# Altium schematic sheet 04-ORIN_HIGH_SPEED_SIGNAL_2.SchDoc: KARGOBOT-TBOX-V2.0
size 513 x 386 mm; Page Create Date: March  8, 1995; Page Number: 7; Page Size: C; Page Count: 81; RevCode: A; DsnPath: C:\Users\Administrator\Desktop\123\KARGOBOT-TCU-ORIN-V1.1.DSN; SchematicName: KARGOBT-TCU-ORIN-V1.1; PageName: 07-ORIN_HIGH_SPEED_SIGNAL_2; PageSize: C; TopSchematic: True
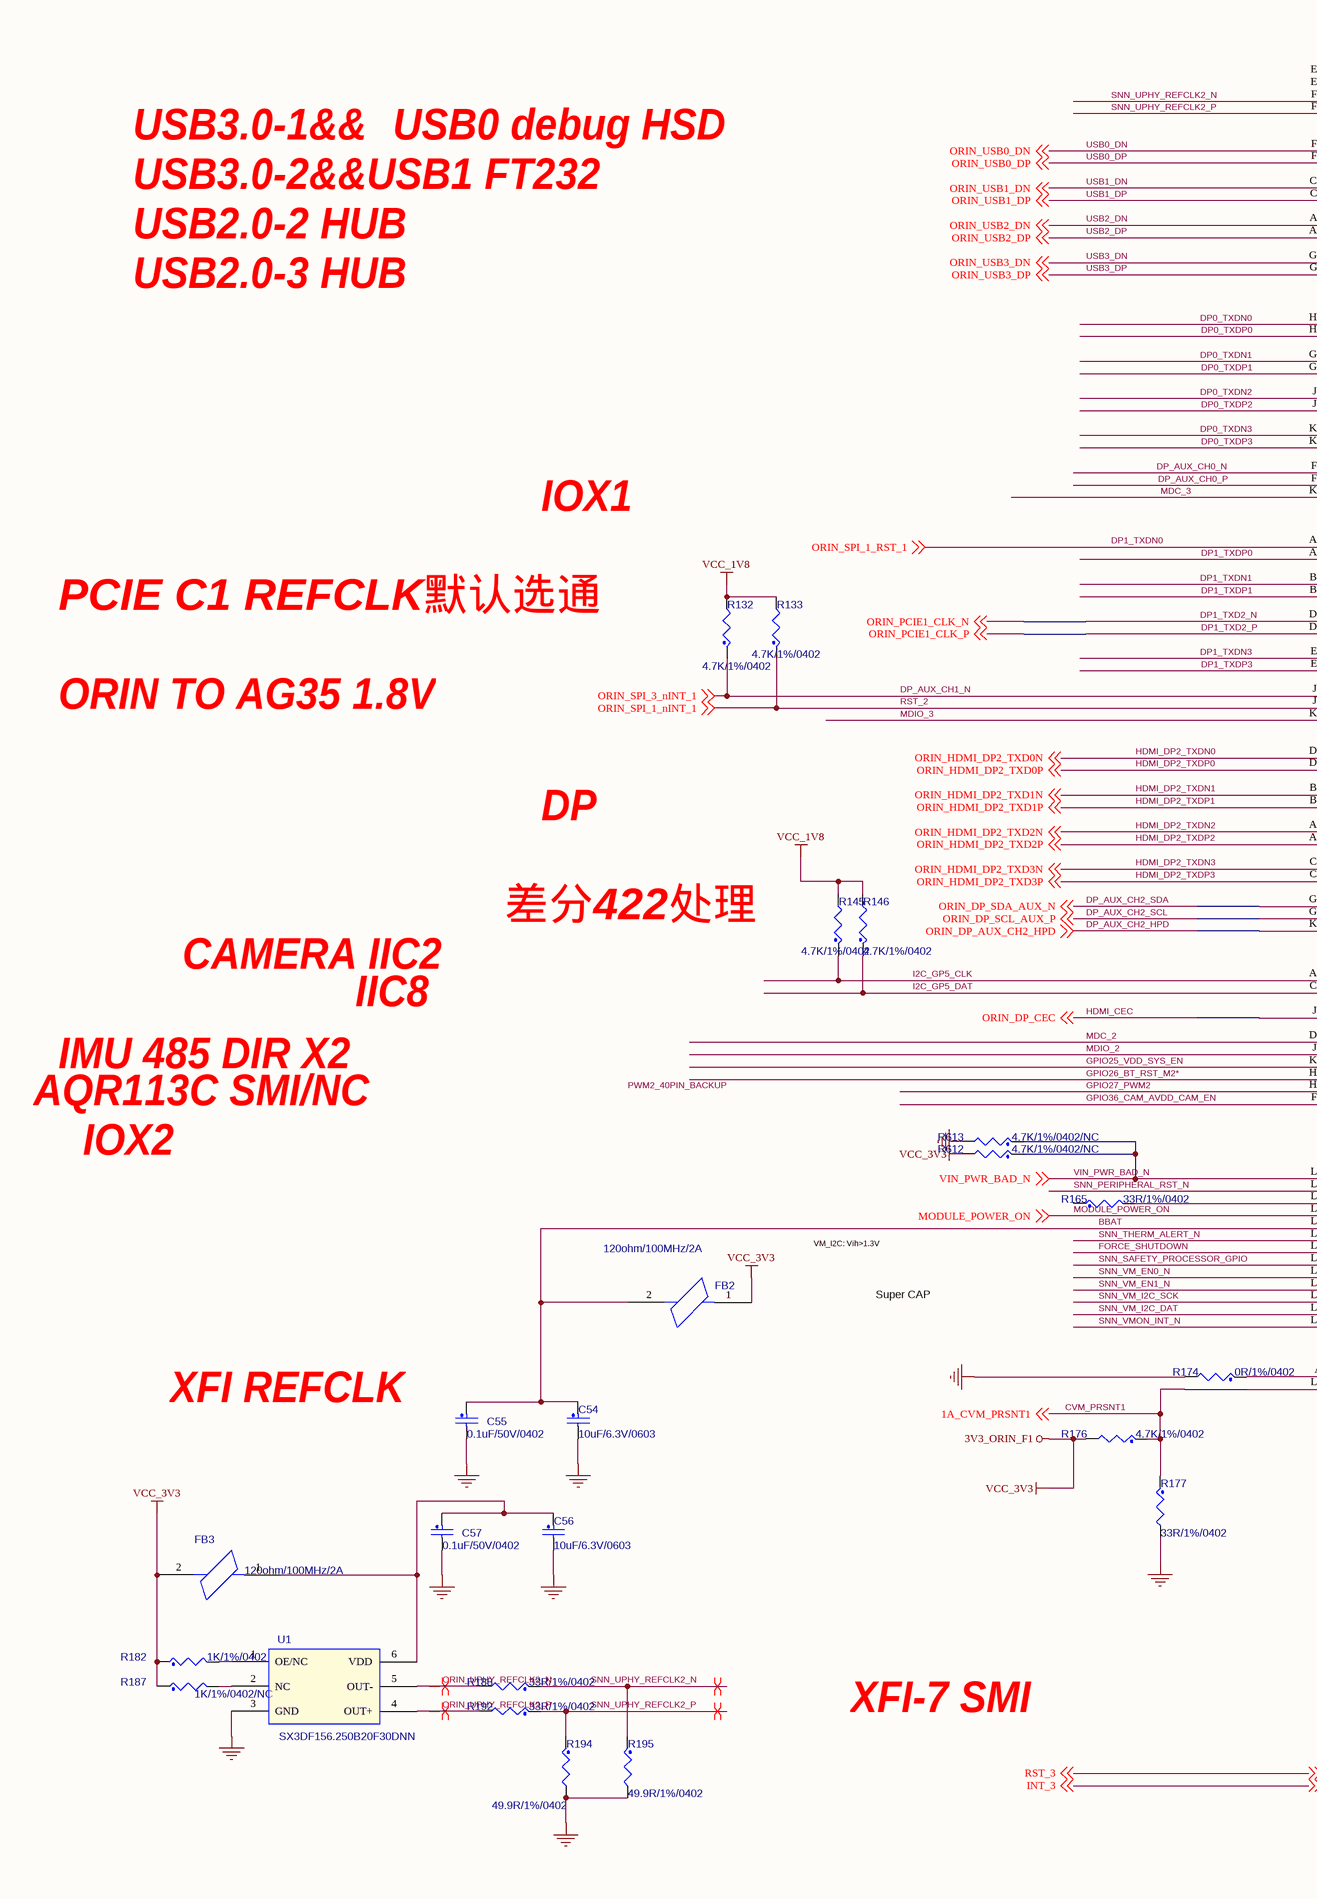
[diagram p0: 04-ORIN_HIGH_SPEED_SIGNAL_2.SchDoc, left]
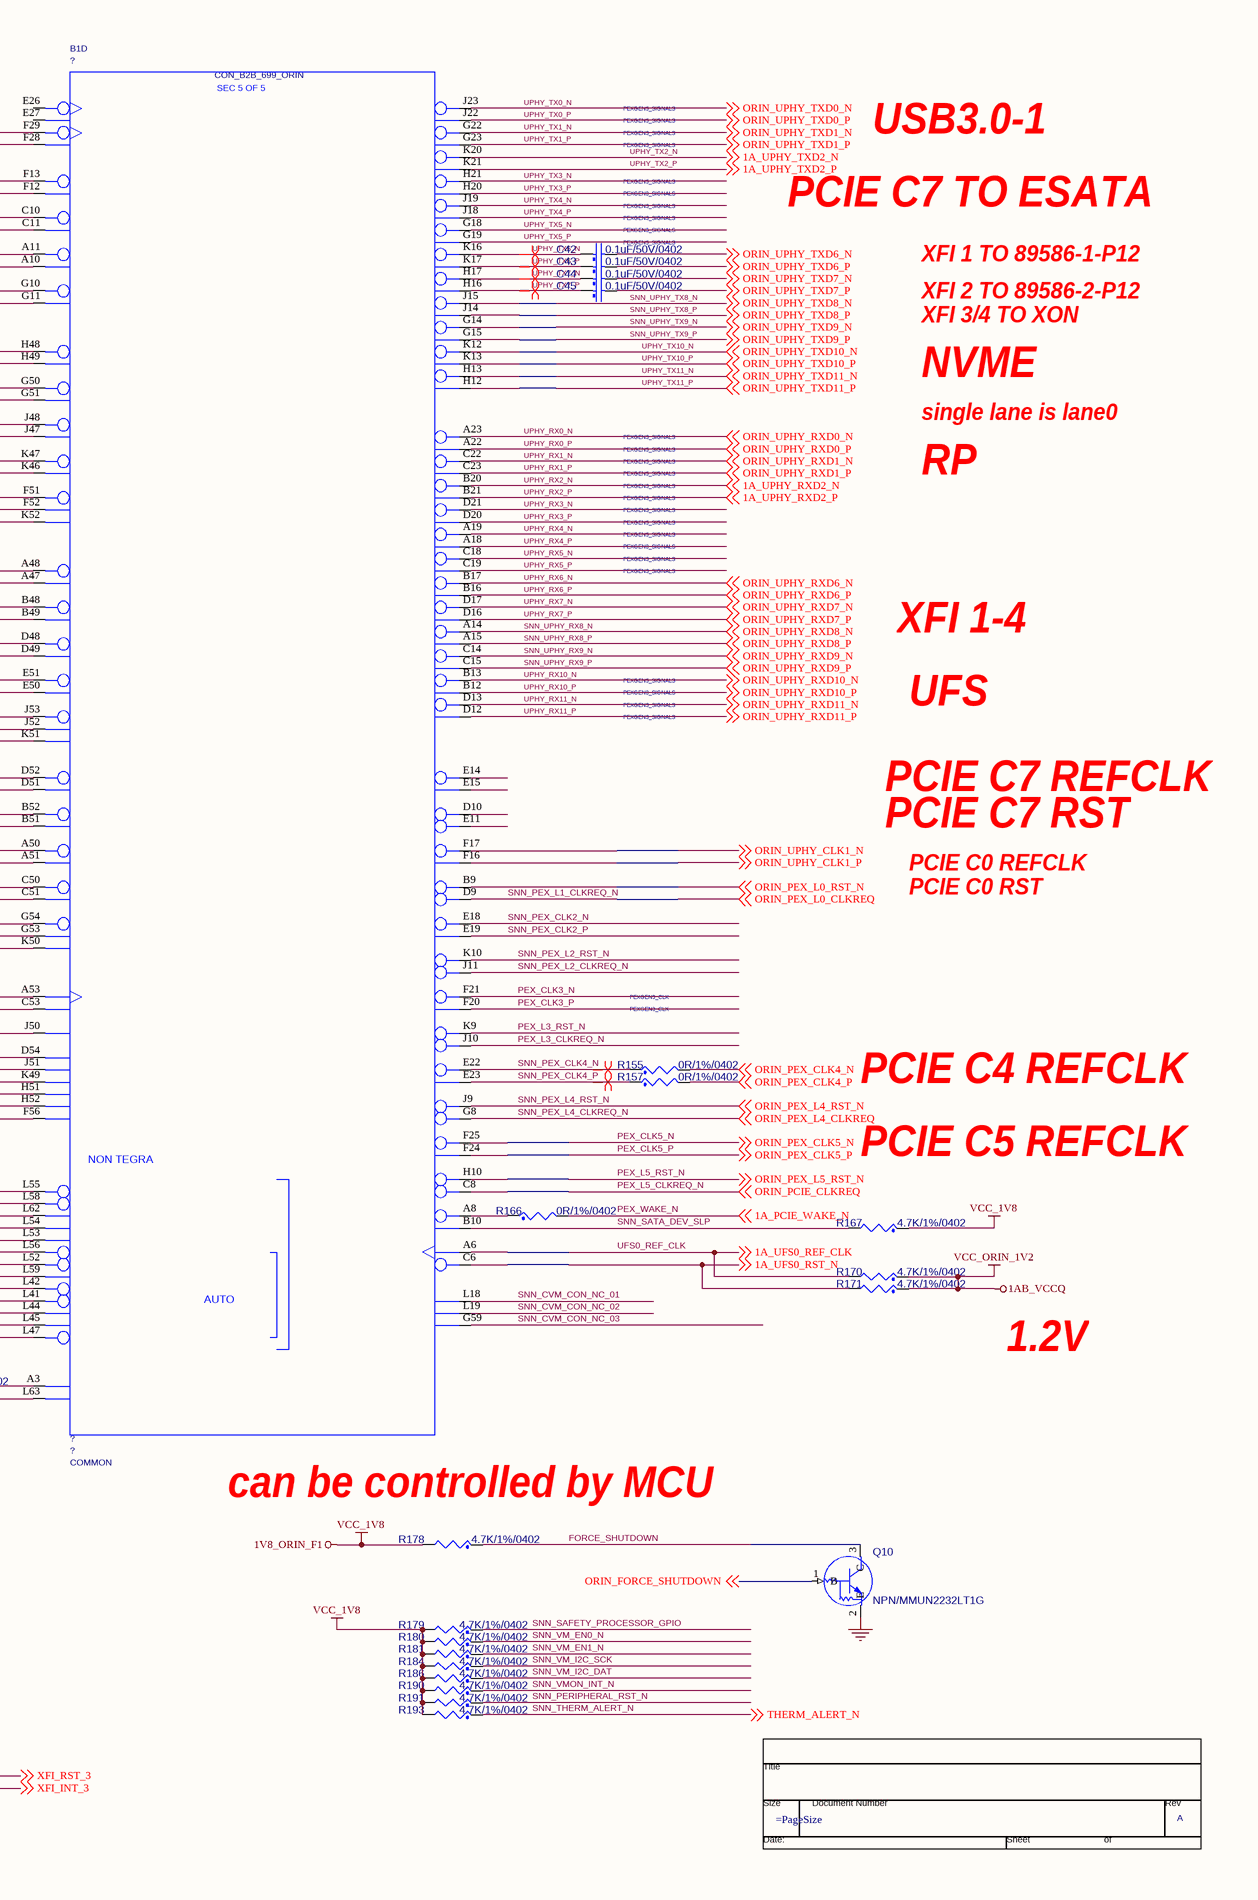
[diagram p1: 04-ORIN_HIGH_SPEED_SIGNAL_2.SchDoc, right]

## Parts
*  RevCode: A  (graphical)
B1  SKU: COMMON  [CON_MIRMEZ_699_BGA_ST_P009_P013_P015_REVERSE]  (hidden comment: CON_B2B_699_ORIN)  (part D of 5)
C42  value 0.1uF/50V/0402  [C0402]  (hidden comment: CAP_NP)
C43  value 0.1uF/50V/0402  [C0402]  (hidden comment: CAP_NP)
C44  value 0.1uF/50V/0402  [C0402]  (hidden comment: CAP_NP)
C45  value 0.1uF/50V/0402  [C0402]  (hidden comment: CAP_NP)
C54  value 10uF/6.3V/0603  [C0603]  (hidden comment: CAP_NP)
C55  value 0.1uF/50V/0402  [C0402]  (hidden comment: CAP_NP)
C56  value 10uF/6.3V/0603  [C0603]  (hidden comment: CAP_NP)
C57  value 0.1uF/50V/0402  [C0402]  (hidden comment: CAP_NP)
FB2  value 120ohm/100MHz/2A  [L0603]  (hidden comment: BEAD_FERRITE)
FB3  value 120ohm/100MHz/2A  [L0603]  (hidden comment: BEAD_FERRITE)
Q10  NPN/MMUN2232LT1G  [SOT-23]
R132  value 4.7K/1%/0402  [R0402]  (hidden comment: RES_Dup2)
R133  value 4.7K/1%/0402  [R0402]  (hidden comment: RES_Dup2)
R145  value 4.7K/1%/0402  [R0402]  (hidden comment: RES_Dup2)
R146  value 4.7K/1%/0402  [R0402]  (hidden comment: RES_Dup2)
R155  value 0R/1%/0402  [R0402]  (hidden comment: RES_Dup2)
R157  value 0R/1%/0402  [R0402]  (hidden comment: RES_Dup2)
R165  value 33R/1%/0402  [R0402]  (hidden comment: RES_Dup2)
R166  value 0R/1%/0402  [R0402]  (hidden comment: RES_Dup2)
R167  value 4.7K/1%/0402  [R0402]  (hidden comment: RES_Dup2)
R170  value 4.7K/1%/0402  [R0402]  (hidden comment: RES_Dup2)
R171  value 4.7K/1%/0402  [R0402]  (hidden comment: RES_Dup2)
R174  value 0R/1%/0402  [R0402]  (hidden comment: RES_Dup2)
R176  value 4.7K/1%/0402  [R0402]  (hidden comment: RES_Dup2)
R177  value 33R/1%/0402  [R0402]  (hidden comment: RES_Dup2)
R178  value 4.7K/1%/0402  [R0402]  (hidden comment: RES_Dup2)
R179  value 4.7K/1%/0402  [R0402]  (hidden comment: RES_Dup2)
R180  value 4.7K/1%/0402  [R0402]  (hidden comment: RES_Dup2)
R181  value 4.7K/1%/0402  [R0402]  (hidden comment: RES_Dup2)
R182  value 1K/1%/0402  [R0402]  (hidden comment: RES_Dup2)
R184  value 4.7K/1%/0402  [R0402]  (hidden comment: RES_Dup2)
R186  value 4.7K/1%/0402  [R0402]  (hidden comment: RES_Dup2)
R187  value 1K/1%/0402/NC  [R0402]  (hidden comment: RES_Dup2)
R188  value 33R/1%/0402  [R0402]  (hidden comment: RES_Dup2)
R190  value 4.7K/1%/0402  [R0402]  (hidden comment: RES_Dup2)
R191  value 4.7K/1%/0402  [R0402]  (hidden comment: RES_Dup2)
R192  value 33R/1%/0402  [R0402]  (hidden comment: RES_Dup2)
R193  value 4.7K/1%/0402  [R0402]  (hidden comment: RES_Dup2)
R194  value 49.9R/1%/0402  [R0402]  (hidden comment: RES_Dup2)
R195  value 49.9R/1%/0402  [R0402]  (hidden comment: RES_Dup2)
R612  value 4.7K/1%/0402/NC  [R0402]  (hidden comment: RES_Dup2)
R613  value 4.7K/1%/0402/NC  [R0402]  (hidden comment: RES_Dup2)
U1  SX3DF156.250B20F30DNN  [SX3DF156.250B20F30DNN]

## Nets
1AB_VCCQ: R170.1 R171.1  [also labelled VCC_ORIN_1V2]
1V8_ORIN_F1: R132.2 R133.2 R145.2 R146.2 R167.1 R178.2 R179.2 R180.2 R181.2 R184.2 R186.2 R190.2 R191.2 R193.2  [also labelled VCC_1V8]
3V3_ORIN_F1: FB2.1 FB3.2 R176.2 R182.1 R187.1 R612.2  [also labelled VCC_3V3]
GND: C54.2 C55.2 C56.2 C57.2 Q10.2(E) R174.2 R177.2 R194.2 R195.2 R613.2 U1.3(GND)
1A_UFS0_RST_N: B1.C6(UFS0_RST_N) R171.2 ; off-sheet 1A_UFS0_RST_N
BBAT: B1.L53(VCC_RTC) C54.1 C55.1 FB2.2
CVM_PRSNT1: B1.L63(PRSNT1) R176.1 R177.1 ; off-sheet 1A_CVM_PRSNT1  [also labelled 1A_CVM_PRSNT1]
DP0_TXDN0: B1.H48(HDMI_DP0_TX0_N)
DP0_TXDN1: B1.G50(HDMI_DP0_TX1_N)
DP0_TXDN2: B1.J48(HDMI_DP0_TX2_N)
DP0_TXDN3: B1.K47(HDMI_DP0_TX3_N)
DP0_TXDP0: B1.H49(HDMI_DP0_TX0_P)
DP0_TXDP1: B1.G51(HDMI_DP0_TX1_P)
DP0_TXDP2: B1.J47(HDMI_DP0_TX2_P)
DP0_TXDP3: B1.K46(HDMI_DP0_TX3_P)
DP1_TXD2_N: B1.D48(HDMI_DP1_TX2_N) ; off-sheet ORIN_PCIE1_CLK_N  [also labelled ORIN_PCIE1_CLK_N]
DP1_TXD2_P: B1.D49(HDMI_DP1_TX2_P) ; off-sheet ORIN_PCIE1_CLK_P  [also labelled ORIN_PCIE1_CLK_P]
DP1_TXDN0: B1.A48(HDMI_DP1_TX0_N) ; off-sheet ORIN_SPI_1_RST_1  [also labelled ORIN_SPI_1_RST_1]
DP1_TXDN1: B1.B48(HDMI_DP1_TX1_N)
DP1_TXDN3: B1.E51(HDMI_DP1_TX3_N)
DP1_TXDP0: B1.A47(HDMI_DP1_TX0_P)
DP1_TXDP1: B1.B49(HDMI_DP1_TX1_P)
DP1_TXDP3: B1.E50(HDMI_DP1_TX3_P)
DP_AUX_CH0_N: B1.F51(DP0_AUX_CH_N)
DP_AUX_CH0_P: B1.F52(DP0_AUX_CH_P)
DP_AUX_CH1_N: B1.J53(DP1_AUX_CH_N) R132.1 ; off-sheet ORIN_SPI_3_nINT_1  [also labelled ORIN_SPI_3_nINT_1]
DP_AUX_CH2_HPD: B1.K50(DP2_HPD) ; off-sheet ORIN_DP_AUX_CH2_HPD  [also labelled ORIN_DP_AUX_CH2_HPD]
DP_AUX_CH2_SCL: B1.G53(DP2_AUX_CH_P) ; off-sheet ORIN_DP_SCL_AUX_P  [also labelled ORIN_DP_SCL_AUX_P]
DP_AUX_CH2_SDA: B1.G54(DP2_AUX_CH_N) ; off-sheet ORIN_DP_SDA_AUX_N  [also labelled ORIN_DP_SDA_AUX_N]
FORCE_SHUTDOWN: B1.L52(OVERTEMP_N) Q10.3(C) R178.1
GPIO25_VDD_SYS_EN: B1.K49(GPIO25)
GPIO26_BT_RST_M2*: B1.H51(GPIO26)
GPIO27_PWM2: B1.H52(GPIO27)
GPIO36_CAM_AVDD_CAM_EN: B1.F56(GPIO36)
HDMI_CEC: B1.J50(HDMI_CEC) ; off-sheet ORIN_DP_CEC  [also labelled ORIN_DP_CEC]
HDMI_DP2_TXDN0: B1.D52(HDMI_DP2_TX0_N) ; off-sheet ORIN_HDMI_DP2_TXD0N  [also labelled ORIN_HDMI_DP2_TXD0N]
HDMI_DP2_TXDN1: B1.B52(HDMI_DP2_TX1_N) ; off-sheet ORIN_HDMI_DP2_TXD1N  [also labelled ORIN_HDMI_DP2_TXD1N]
HDMI_DP2_TXDN2: B1.A50(HDMI_DP2_TX2_N) ; off-sheet ORIN_HDMI_DP2_TXD2N  [also labelled ORIN_HDMI_DP2_TXD2N]
HDMI_DP2_TXDN3: B1.C50(HDMI_DP2_TX3_N) ; off-sheet ORIN_HDMI_DP2_TXD3N  [also labelled ORIN_HDMI_DP2_TXD3N]
HDMI_DP2_TXDP0: B1.D51(HDMI_DP2_TX0_P) ; off-sheet ORIN_HDMI_DP2_TXD0P  [also labelled ORIN_HDMI_DP2_TXD0P]
HDMI_DP2_TXDP1: B1.B51(HDMI_DP2_TX1_P) ; off-sheet ORIN_HDMI_DP2_TXD1P  [also labelled ORIN_HDMI_DP2_TXD1P]
HDMI_DP2_TXDP2: B1.A51(HDMI_DP2_TX2_P) ; off-sheet ORIN_HDMI_DP2_TXD2P  [also labelled ORIN_HDMI_DP2_TXD2P]
HDMI_DP2_TXDP3: B1.C51(HDMI_DP2_TX3_P) ; off-sheet ORIN_HDMI_DP2_TXD3P  [also labelled ORIN_HDMI_DP2_TXD3P]
I2C_GP5_CLK: B1.A53(I2C5_CLK) R145.1
I2C_GP5_DAT: B1.C53(I2C5_DAT) R146.1
INT_3: off-sheet INT_3, off-sheet XFI_INT_3  [also labelled XFI_INT_3]
MDC_2: B1.D54(GPIO03)
MDC_3: B1.K52(DP0_HPD)
MDIO_2: B1.J51(GPIO24)
MDIO_3: B1.K51(DP1_HPD)
MODULE_POWER_ON: B1.L54(MODULE_POWER_ON) ; off-sheet MODULE_POWER_ON
ORIN_FORCE_SHUTDOWN: Q10.1(B) ; off-sheet ORIN_FORCE_SHUTDOWN
ORIN_PEX_CLK4_N: R155.2 ; off-sheet ORIN_PEX_CLK4_N
ORIN_PEX_CLK4_P: R157.2 ; off-sheet ORIN_PEX_CLK4_P
ORIN_PEX_L0_RST_N: B1.B9(PEX_C1_RST_N) ; off-sheet ORIN_PEX_L0_RST_N
ORIN_UPHY_CLK1_N: B1.F17(UPHY_REFCLK1_N) ; off-sheet ORIN_UPHY_CLK1_N
ORIN_UPHY_CLK1_P: B1.F16(UPHY_REFCLK1_P) ; off-sheet ORIN_UPHY_CLK1_P
ORIN_UPHY_REFCLK2_N: R188.2 U1.5(OUT-)
ORIN_UPHY_REFCLK2_P: R192.2 U1.4(OUT+)
ORIN_UPHY_TXD6_N: C42.2 ; off-sheet ORIN_UPHY_TXD6_N
ORIN_UPHY_TXD6_P: C43.2 ; off-sheet ORIN_UPHY_TXD6_P
ORIN_UPHY_TXD7_N: C44.2 ; off-sheet ORIN_UPHY_TXD7_N
ORIN_UPHY_TXD7_P: C45.2 ; off-sheet ORIN_UPHY_TXD7_P
PEX_CLK3_N: B1.F21(PEX_CLK3_N)
PEX_CLK3_P: B1.F20(PEX_CLK3_P)
PEX_CLK5_N: B1.F25(PEX_CLK5_N) ; off-sheet ORIN_PEX_CLK5_N  [also labelled ORIN_PEX_CLK5_N]
PEX_CLK5_P: B1.F24(PEX_CLK5_P) ; off-sheet ORIN_PEX_CLK5_P  [also labelled ORIN_PEX_CLK5_P]
PEX_L3_CLKREQ_N: B1.J10(PEX_C3_CLKREQ_N)
PEX_L3_RST_N: B1.K9(PEX_C3_RST_N)
PEX_L5_CLKREQ_N: B1.C8(PEX_C5_CLKREQ_N) ; off-sheet ORIN_PCIE_CLKREQ  [also labelled ORIN_PCIE_CLKREQ]
PEX_L5_RST_N: B1.H10(PEX_C5_RST_N) ; off-sheet ORIN_PEX_L5_RST_N  [also labelled ORIN_PEX_L5_RST_N]
PEX_WAKE_N: R166.2 ; off-sheet 1A_PCIE_WAKE_N  [also labelled 1A_PCIE_WAKE_N]
RST_2: B1.J52(DP1_AUX_CH_P) R133.1 ; off-sheet ORIN_SPI_1_nINT_1  [also labelled ORIN_SPI_1_nINT_1]
RST_3: off-sheet RST_3, off-sheet XFI_RST_3  [also labelled XFI_RST_3]
SNN_CVM_CON_NC_01: B1.L18(NC_01)
SNN_CVM_CON_NC_02: B1.L19(NC_02)
SNN_CVM_CON_NC_03: B1.G59(NC_03)
SNN_PERIPHERAL_RST_N: B1.L58(PERIPHERAL_RESET_N) R191.1
SNN_PEX_CLK2_N: B1.E18(PEX_CLK2_N)
SNN_PEX_CLK2_P: B1.E19(PEX_CLK2_P)
SNN_PEX_CLK4_N: B1.E22(PEX_CLK4_N) R155.1
SNN_PEX_CLK4_P: B1.E23(PEX_CLK4_P) R157.1
SNN_PEX_L1_CLKREQ_N: B1.D9(PEX_C1_CLKREQ_N) ; off-sheet ORIN_PEX_L0_CLKREQ  [also labelled ORIN_PEX_L0_CLKREQ]
SNN_PEX_L2_CLKREQ_N: B1.J11(PEX_C2_CLKREQ_N)
SNN_PEX_L2_RST_N: B1.K10(PEX_C2_RST_N)
SNN_PEX_L4_CLKREQ_N: B1.G8(PEX_C4_CLKREQ_N) ; off-sheet ORIN_PEX_L4_CLKREQ  [also labelled ORIN_PEX_L4_CLKREQ]
SNN_PEX_L4_RST_N: B1.J9(PEX_C4_RST_N) ; off-sheet ORIN_PEX_L4_RST_N  [also labelled ORIN_PEX_L4_RST_N]
SNN_SAFETY_PROCESSOR_GPIO: B1.L59(SAFETY_PROCESSOR_GPIO) R179.1
SNN_SATA_DEV_SLP: B1.B10(SATA_DEV_SLP) R167.2
SNN_THERM_ALERT_N: B1.L56(TEMP_ALERT_N) R193.1 ; off-sheet THERM_ALERT_N  [also labelled THERM_ALERT_N]
SNN_UPHY_REFCLK2_N: B1.F29(UPHY_REFCLK2_N) R188.1 R195.1
SNN_UPHY_REFCLK2_P: B1.F28(UPHY_REFCLK2_P) R192.1 R194.1
SNN_UPHY_RX8_N: B1.A14(UPHY_RX8_N) ; off-sheet ORIN_UPHY_RXD8_N  [also labelled ORIN_UPHY_RXD8_N]
SNN_UPHY_RX8_P: B1.A15(UPHY_RX8_P) ; off-sheet ORIN_UPHY_RXD8_P  [also labelled ORIN_UPHY_RXD8_P]
SNN_UPHY_RX9_N: B1.C14(UPHY_RX9_N) ; off-sheet ORIN_UPHY_RXD9_N  [also labelled ORIN_UPHY_RXD9_N]
SNN_UPHY_RX9_P: B1.C15(UPHY_RX9_P) ; off-sheet ORIN_UPHY_RXD9_P  [also labelled ORIN_UPHY_RXD9_P]
SNN_UPHY_TX8_N: B1.J15(UPHY_TX8_N) ; off-sheet ORIN_UPHY_TXD8_N  [also labelled ORIN_UPHY_TXD8_N]
SNN_UPHY_TX8_P: B1.J14(UPHY_TX8_P) ; off-sheet ORIN_UPHY_TXD8_P  [also labelled ORIN_UPHY_TXD8_P]
SNN_UPHY_TX9_N: B1.G14(UPHY_TX9_N) ; off-sheet ORIN_UPHY_TXD9_N  [also labelled ORIN_UPHY_TXD9_N]
SNN_UPHY_TX9_P: B1.G15(UPHY_TX9_P) ; off-sheet ORIN_UPHY_TXD9_P  [also labelled ORIN_UPHY_TXD9_P]
SNN_VM_EN0_N: B1.L42(VM_EN0_N) R180.1
SNN_VM_EN1_N: B1.L41(VM_EN1_N) R181.1
SNN_VM_I2C_DAT: B1.L45(VM_I2C_DAT) R186.1
SNN_VM_I2C_SCK: B1.L44(VM_I2C_SCK) R184.1
SNN_VMON_INT_N: B1.L47(VM_INT_N) R190.1
UFS0_REF_CLK: B1.A6(UFS0_REF_CLK) R170.2 ; off-sheet 1A_UFS0_REF_CLK  [also labelled 1A_UFS0_REF_CLK]
UPHY_RX0_N: B1.A23(UPHY_RX0_N) ; off-sheet ORIN_UPHY_RXD0_N  [also labelled ORIN_UPHY_RXD0_N]
UPHY_RX0_P: B1.A22(UPHY_RX0_P) ; off-sheet ORIN_UPHY_RXD0_P  [also labelled ORIN_UPHY_RXD0_P]
UPHY_RX1_N: B1.C22(UPHY_RX1_N) ; off-sheet ORIN_UPHY_RXD1_N  [also labelled ORIN_UPHY_RXD1_N]
UPHY_RX1_P: B1.C23(UPHY_RX1_P) ; off-sheet ORIN_UPHY_RXD1_P  [also labelled ORIN_UPHY_RXD1_P]
UPHY_RX2_N: B1.B20(UPHY_RX2_N) ; off-sheet 1A_UPHY_RXD2_N  [also labelled 1A_UPHY_RXD2_N]
UPHY_RX2_P: B1.B21(UPHY_RX2_P) ; off-sheet 1A_UPHY_RXD2_P  [also labelled 1A_UPHY_RXD2_P]
UPHY_RX3_N: B1.D21(UPHY_RX3_N)
UPHY_RX3_P: B1.D20(UPHY_RX3_P)
UPHY_RX4_N: B1.A19(UPHY_RX4_N)
UPHY_RX4_P: B1.A18(UPHY_RX4_P)
UPHY_RX5_N: B1.C18(UPHY_RX5_N)
UPHY_RX5_P: B1.C19(UPHY_RX5_P)
UPHY_RX6_N: B1.B17(UPHY_RX6_N) ; off-sheet ORIN_UPHY_RXD6_N  [also labelled ORIN_UPHY_RXD6_N]
UPHY_RX6_P: B1.B16(UPHY_RX6_P) ; off-sheet ORIN_UPHY_RXD6_P  [also labelled ORIN_UPHY_RXD6_P]
UPHY_RX7_N: B1.D17(UPHY_RX7_N) ; off-sheet ORIN_UPHY_RXD7_N  [also labelled ORIN_UPHY_RXD7_N]
UPHY_RX7_P: B1.D16(UPHY_RX7_P) ; off-sheet ORIN_UPHY_RXD7_P  [also labelled ORIN_UPHY_RXD7_P]
UPHY_RX10_N: B1.B13(UPHY_RX10_N) ; off-sheet ORIN_UPHY_RXD10_N  [also labelled ORIN_UPHY_RXD10_N]
UPHY_RX10_P: B1.B12(UPHY_RX10_P) ; off-sheet ORIN_UPHY_RXD10_P  [also labelled ORIN_UPHY_RXD10_P]
UPHY_RX11_N: B1.D13(UPHY_RX11_N) ; off-sheet ORIN_UPHY_RXD11_N  [also labelled ORIN_UPHY_RXD11_N]
UPHY_RX11_P: B1.D12(UPHY_RX11_P) ; off-sheet ORIN_UPHY_RXD11_P  [also labelled ORIN_UPHY_RXD11_P]
UPHY_TX0_N: B1.J23(UPHY_TX0_N) ; off-sheet ORIN_UPHY_TXD0_N  [also labelled ORIN_UPHY_TXD0_N]
UPHY_TX0_P: B1.J22(UPHY_TX0_P) ; off-sheet ORIN_UPHY_TXD0_P  [also labelled ORIN_UPHY_TXD0_P]
UPHY_TX1_N: B1.G22(UPHY_TX1_N) ; off-sheet ORIN_UPHY_TXD1_N  [also labelled ORIN_UPHY_TXD1_N]
UPHY_TX1_P: B1.G23(UPHY_TX1_P) ; off-sheet ORIN_UPHY_TXD1_P  [also labelled ORIN_UPHY_TXD1_P]
UPHY_TX2_N: B1.K20(UPHY_TX2_N) ; off-sheet 1A_UPHY_TXD2_N  [also labelled 1A_UPHY_TXD2_N]
UPHY_TX2_P: B1.K21(UPHY_TX2_P) ; off-sheet 1A_UPHY_TXD2_P  [also labelled 1A_UPHY_TXD2_P]
UPHY_TX3_N: B1.H21(UPHY_TX3_N)
UPHY_TX3_P: B1.H20(UPHY_TX3_P)
UPHY_TX4_N: B1.J19(UPHY_TX4_N)
UPHY_TX4_P: B1.J18(UPHY_TX4_P)
UPHY_TX5_N: B1.G18(UPHY_TX5_N)
UPHY_TX5_P: B1.G19(UPHY_TX5_P)
UPHY_TX6_N: B1.K16(UPHY_TX6_N) C42.1
UPHY_TX6_P: B1.K17(UPHY_TX6_P) C43.1
UPHY_TX7_N: B1.H17(UPHY_TX7_N) C44.1
UPHY_TX7_P: B1.H16(UPHY_TX7_P) C45.1
UPHY_TX10_N: B1.K12(UPHY_TX10_N) ; off-sheet ORIN_UPHY_TXD10_N  [also labelled ORIN_UPHY_TXD10_N]
UPHY_TX10_P: B1.K13(UPHY_TX10_P) ; off-sheet ORIN_UPHY_TXD10_P  [also labelled ORIN_UPHY_TXD10_P]
UPHY_TX11_N: B1.H13(UPHY_TX11_N) ; off-sheet ORIN_UPHY_TXD11_N  [also labelled ORIN_UPHY_TXD11_N]
UPHY_TX11_P: B1.H12(UPHY_TX11_P) ; off-sheet ORIN_UPHY_TXD11_P  [also labelled ORIN_UPHY_TXD11_P]
USB0_DN: B1.F13(USB0_N) ; off-sheet ORIN_USB0_DN  [also labelled ORIN_USB0_DN]
USB0_DP: B1.F12(USB0_P) ; off-sheet ORIN_USB0_DP  [also labelled ORIN_USB0_DP]
USB1_DN: B1.C10(USB1_N) ; off-sheet ORIN_USB1_DN  [also labelled ORIN_USB1_DN]
USB1_DP: B1.C11(USB1_P) ; off-sheet ORIN_USB1_DP  [also labelled ORIN_USB1_DP]
USB2_DN: B1.A11(USB2_N) ; off-sheet ORIN_USB2_DN  [also labelled ORIN_USB2_DN]
USB2_DP: B1.A10(USB2_P) ; off-sheet ORIN_USB2_DP  [also labelled ORIN_USB2_DP]
USB3_DN: B1.G10(USB3_N) ; off-sheet ORIN_USB3_DN  [also labelled ORIN_USB3_DN]
USB3_DP: B1.G11(USB3_P) ; off-sheet ORIN_USB3_DP  [also labelled ORIN_USB3_DP]
VIN_PWR_BAD_N: B1.L55(VDDIN_PWR_BAD_N) R612.1 R613.1 ; off-sheet VIN_PWR_BAD_N
NetB1_A3: B1.A3(PRSNT0) R174.1
NetB1_A8: B1.A8(PEX_WAKE_N) R166.1
NetB1_L62: B1.L62(CARRIER_POWER_ON) R165.2
NetC56_1: C56.1 C57.1 FB3.1 U1.6(VDD)
NetR182_2: R182.2 U1.1(OE/NC)
NetR187_2: R187.2 U1.2(NC)

Not connected (* = marked no-connect by the designer): B1 D10(PEX_C0_RST_N) E11(PEX_C0_CLKREQ_N) E14(PEX_CLK0_N) E15(PEX_CLK0_P) E26(UPHY_REFCLK6_N) E27(UPHY_REFCLK6_P); R165 1

## Layout directives
differential pair: ORIN_UPHY_REFCLK2_N, ORIN_UPHY_REFCLK2_P, SNN_PEX_CLK4_N, SNN_PEX_CLK4_P, SNN_UPHY_REFCLK2_N, SNN_UPHY_REFCLK2_P, UPHY_TX6_N, UPHY_TX6_P, UPHY_TX7_N, UPHY_TX7_P

## Notes on the sheet
- PEXGEN3_SIGNALS
- USB3.0-1&&
- USB0 debug HSD
- USB3.0-1
- USB3.0-2&&USB1 FT232
- PCIE C7 TO ESATA
- USB2.0-2 HUB
- XFI 2 TO 89586-2-P12
- XFI 1 TO 89586-1-P12
- USB2.0-3 HUB
- XFI 3/4 TO XON
- NVME
- single lane is lane0
- RP
- IOX1
- PCIE C1 REFCLK默认选通
- XFI 1-4
- UFS
- ORIN TO AG35 1.8V
- DP
- PCIE C7 REFCLK
- PCIE C7 RST
- PCIE C0 REFCLK
- PCIE C0 RST
- 差分422处理
- CAMERA IIC2
- IIC8
- PEXGEN3_CLK
- IMU 485 DIR X2
- PCIE C4 REFCLK
- AQR113C SMI/NC
- IOX2
- PCIE C5 REFCLK
- VM_I2C: Vih>1.3V
- Super CAP
- 1.2V
- XFI REFCLK
- (near R178) can be controlled by MCU
- XFI-7 SMI
- Labels drawn without touching a wire or pin: PWM2_40PIN_BACKUP
- (in symbol CON_B2B_699, part D) SEC 5 OF 5; NON TEGRA; AUTO
- (in symbol TitleBlock0) Title; Size; Document Number; Rev; Date:; Sheet; of

## Library data of the parts
* = TitleBlock0: Title: KARGOBOT-TBOX-V2.0; Page Number: 7; Page Count: 81; Page Create Date: March  8, 1995; Page Size: =PageSize; Page Modify Date: =ModifiedDate
B1 = CON_B2B_699: 2034560003/MOLEX; Part Reference: B1; OriginalSymbolOrigin: (-500,1750); ASSEMBLY: ?; DEVICE: CON_B2B_699_ORIN; NV_PN: ?; PACK_TYPE: ?; PATH: ?; PLACEMENT_NOTE: ?; Value: CON_B2B_699_ORIN; PCB Footprint: CON_MIRMEZ_699_BGA_ST_P009_P013_P015_REVERSE
C42 = CAP_NP: GCM155R71H104KE02/MURATA; Part Reference: C37; CLASS: DISCRETE; FPLIST: CC0402_25,CC0402_HD,CC0402_CC; CAD_APPROVED: Yes; MFG_PN01: 0402YC104KAT2A; MFG_NAME01: AVX; Tolerance: 10%; AGILE_PN: 150-75182; VOLTAGE: 16V; HEIGHT: 0.635MM; ROHS: Yes; TOL: 10%; PCB Footprint: C0402
C43 = CAP_NP: GCM155R71H104KE02/MURATA; Part Reference: C38; CLASS: DISCRETE; FPLIST: CC0402_25,CC0402_HD,CC0402_CC; CAD_APPROVED: Yes; MFG_PN01: 0402YC104KAT2A; MFG_NAME01: AVX; Tolerance: 10%; AGILE_PN: 150-75182; VOLTAGE: 16V; HEIGHT: 0.635MM; ROHS: Yes; TOL: 10%; PCB Footprint: C0402
C44 = CAP_NP: GCM155R71H104KE02/MURATA; Part Reference: C39; CLASS: DISCRETE; FPLIST: CC0402_25,CC0402_HD,CC0402_CC; CAD_APPROVED: Yes; MFG_PN01: 0402YC104KAT2A; MFG_NAME01: AVX; Tolerance: 10%; AGILE_PN: 150-75182; VOLTAGE: 16V; HEIGHT: 0.635MM; ROHS: Yes; TOL: 10%; PCB Footprint: C0402
C45 = CAP_NP: GCM155R71H104KE02/MURATA; Part Reference: C40; CLASS: DISCRETE; FPLIST: CC0402_25,CC0402_HD,CC0402_CC; CAD_APPROVED: Yes; MFG_PN01: 0402YC104KAT2A; MFG_NAME01: AVX; Tolerance: 10%; AGILE_PN: 150-75182; VOLTAGE: 16V; HEIGHT: 0.635MM; ROHS: Yes; TOL: 10%; PCB Footprint: C0402
C54 = CAP_NP: GCM188D70J106ME36/MURATA; Part Reference: C46; CLASS: DISCRETE; VOLTAGE: 10v; CAD_APPROVED: Yes; MFG_PN01: C1608X5R1A106K; MFG_NAME01: TDK; TOL: 10%; AGILE_PN: 150-78675; FPLIST: CC0603_OV,CC0603,0603_CC; HEIGHT: 1.016MM; ROHS: Yes; Tolerance: 10%; PCB Footprint: C0603
C55 = CAP_NP: GCM155R71H104KE02/MURATA; Part Reference: C45; CLASS: DISCRETE; FPLIST: CC0402_25,CC0402_HD,CC0402_CC; CAD_APPROVED: Yes; MFG_PN01: 0402YC104KAT2A; MFG_NAME01: AVX; Tolerance: 10%; AGILE_PN: 150-75182; VOLTAGE: 16V; HEIGHT: 0.635MM; ROHS: Yes; TOL: 10%; PCB Footprint: C0402
C56 = CAP_NP: GCM188D70J106ME36/MURATA; Part Reference: C48; CLASS: DISCRETE; VOLTAGE: 10v; CAD_APPROVED: Yes; MFG_PN01: C1608X5R1A106K; MFG_NAME01: TDK; TOL: 10%; AGILE_PN: 150-78675; FPLIST: CC0603_OV,CC0603,0603_CC; HEIGHT: 1.016MM; ROHS: Yes; Tolerance: 10%; PCB Footprint: C0603
C57 = CAP_NP: GCM155R71H104KE02/MURATA; Part Reference: C47; CLASS: DISCRETE; FPLIST: CC0402_25,CC0402_HD,CC0402_CC; CAD_APPROVED: Yes; MFG_PN01: 0402YC104KAT2A; MFG_NAME01: AVX; Tolerance: 10%; AGILE_PN: 150-75182; VOLTAGE: 16V; HEIGHT: 0.635MM; ROHS: Yes; TOL: 10%; PCB Footprint: C0402
FB2 = BEAD_FERRITE: BLM18EG121SH1D/MURATA; Part Reference: FB1; PART_TYPE: FERRITE\BEAD; CLASS: DISCRETE; FPLIST: IND_0603A,0603_CC; CAD_APPROVED: Yes; MFG_PN01: BLM18KG121TN1; MFG_NAME01: MURATA; AGILE_PN: 180-78025; HEIGHT: 0.75MM; ROHS: Yes; PCB Footprint: L0603
FB3 = BEAD_FERRITE: BLM18EG121SH1D/MURATA; Part Reference: FB2; PART_TYPE: FERRITE\BEAD; CLASS: DISCRETE; AGILE_PN: 180-78025; MFG_NAME01: MURATA; MFG_PN01: BLM18KG121TN1; CAD_APPROVED: Yes; FPLIST: IND_0603A,0603_CC; ROHS: Yes; HEIGHT: 0.75MM; PCB Footprint: L0603
Q10 = DTC143ZE: MMUN2232LT1G/ONSEMI; Part Reference: Q1; Value: NPN/MMUN2232LT1G; PCB Footprint: SOT-23
R132 = RES_Dup2: AC0402FR-074K7L/YAGEO; Part Reference: R147; CLASS: DISCRETE; FPLIST: RC0402_25,RC0402_HD,RC0402_CC; CAD_APPROVED: Yes; MFG_PN01: RK73B1ETTP472J; MFG_NAME01: KOA SPEER; Tolerance: 5%; AGILE_PN: 470-75626; PCB Footprint: R0402; ROHS: Yes; TOL: 5%; HEIGHT: 0.41mm
R133 = RES_Dup2: AC0402FR-074K7L/YAGEO; Part Reference: R148; CLASS: DISCRETE; FPLIST: RC0402_25,RC0402_HD,RC0402_CC; CAD_APPROVED: Yes; MFG_PN01: RK73B1ETTP472J; MFG_NAME01: KOA SPEER; Tolerance: 5%; AGILE_PN: 470-75626; ROHS: Yes; TOL: 5%; HEIGHT: 0.41mm; PCB Footprint: R0402
R145 = RES_Dup2: AC0402FR-074K7L/YAGEO; Part Reference: R160; CLASS: DISCRETE; TOL: 5%; AGILE_PN: 470-75626; MFG_NAME01: KOA SPEER; MFG_PN01: RK73B1ETTP472J; CAD_APPROVED: Yes; FPLIST: RC0402_25,RC0402_HD,RC0402_CC; HEIGHT: 0.41mm; Tolerance: 5%; ROHS: Yes; PCB Footprint: R0402
R146 = RES_Dup2: AC0402FR-074K7L/YAGEO; Part Reference: R161; CLASS: DISCRETE; FPLIST: RC0402_25,RC0402_HD,RC0402_CC; CAD_APPROVED: Yes; MFG_PN01: RK73B1ETTP472J; MFG_NAME01: KOA SPEER; Tolerance: 5%; AGILE_PN: 470-75626; ROHS: Yes; TOL: 5%; HEIGHT: 0.41mm; PCB Footprint: R0402
R155 = RES_Dup2: AC0402FR-070RL/YAGEO; Part Reference: R4924; CLASS: DISCRETE; TOL: 5%; AGILE_PN: 470-75790; Tolerance: 1%; MFG_NAME01: YAGEO; MFG_PN01: CR-02FL6---33R; CAD_APPROVED: Yes; FPLIST: RC0603_OV; SIGNAL_MODEL: DEFAULT_RESISTOR_33.000000OHM_2_1; HEIGHT: 0.4MM; ROHS: Yes; PCB Footprint: R0402
R157 = RES_Dup2: AC0402FR-070RL/YAGEO; Part Reference: R4925; CLASS: DISCRETE; TOL: 5%; AGILE_PN: 470-75790; Tolerance: 1%; MFG_NAME01: YAGEO; MFG_PN01: CR-02FL6---33R; CAD_APPROVED: Yes; FPLIST: RC0603_OV; SIGNAL_MODEL: DEFAULT_RESISTOR_33.000000OHM_2_1; HEIGHT: 0.4MM; ROHS: Yes; PCB Footprint: R0402
R165 = RES_Dup2: AC0402FR-0733RL/YAGEO; Part Reference: R178; CLASS: DISCRETE; TOL: 5%; AGILE_PN: 470-75790; Tolerance: 1%; MFG_NAME01: YAGEO; MFG_PN01: CR-02FL6---33R; CAD_APPROVED: Yes; FPLIST: RC0603_OV; SIGNAL_MODEL: DEFAULT_RESISTOR_33.000000OHM_2_1; HEIGHT: 0.4MM; ROHS: Yes; PCB Footprint: R0402
R166 = RES_Dup2: AC0402FR-070RL/YAGEO; Part Reference: R179; CLASS: DISCRETE; SIGNAL_MODEL: DEFAULT_RESISTOR_33.000000OHM_2_1; FPLIST: RC0603_OV; CAD_APPROVED: Yes; MFG_PN01: CR-02FL6---33R; MFG_NAME01: YAGEO; Tolerance: 1%; AGILE_PN: 470-75790; TOL: 5%; ROHS: Yes; HEIGHT: 0.4MM; PCB Footprint: R0402
R167 = RES_Dup2: AC0402FR-074K7L/YAGEO; Part Reference: R180; CLASS: DISCRETE; FPLIST: RC0402_25,RC0402_HD,RC0402_CC; CAD_APPROVED: Yes; MFG_PN01: RK73B1ETTP472J; MFG_NAME01: KOA SPEER; Tolerance: 5%; AGILE_PN: 470-75626; ROHS: Yes; TOL: 5%; HEIGHT: 0.41mm; PCB Footprint: R0402
R170 = RES_Dup2: AC0402FR-074K7L/YAGEO; Part Reference: R183; CLASS: DISCRETE; TOL: 5%; AGILE_PN: 470-75626; MFG_NAME01: KOA SPEER; MFG_PN01: RK73B1ETTP472J; CAD_APPROVED: Yes; FPLIST: RC0402_25,RC0402_HD,RC0402_CC; HEIGHT: 0.41mm; Tolerance: 5%; ROHS: Yes; PCB Footprint: R0402
R171 = RES_Dup2: AC0402FR-074K7L/YAGEO; Part Reference: R184; CLASS: DISCRETE; FPLIST: RC0402_25,RC0402_HD,RC0402_CC; CAD_APPROVED: Yes; MFG_PN01: RK73B1ETTP472J; MFG_NAME01: KOA SPEER; Tolerance: 5%; AGILE_PN: 470-75626; ROHS: Yes; TOL: 5%; HEIGHT: 0.41mm; PCB Footprint: R0402
R174 = RES_Dup2: AC0402FR-070RL/YAGEO; Part Reference: R187; CLASS: DISCRETE; TOL: 5%; AGILE_PN: 470-75626; MFG_NAME01: KOA SPEER; MFG_PN01: RK73B1ETTP472J; CAD_APPROVED: Yes; FPLIST: RC0402_25,RC0402_HD,RC0402_CC; HEIGHT: 0.41mm; Tolerance: 5%; ROHS: Yes; PCB Footprint: R0402
R176 R612 R613 = RES_Dup2: AC0402FR-074K7L/YAGEO; Part Reference: R189; CLASS: DISCRETE; FPLIST: RC0402_25,RC0402_HD,RC0402_CC; CAD_APPROVED: Yes; MFG_PN01: RK73B1ETTP472J; MFG_NAME01: KOA SPEER; Tolerance: 5%; AGILE_PN: 470-75626; ROHS: Yes; TOL: 5%; HEIGHT: 0.41mm; PCB Footprint: R0402
R177 = RES_Dup2: AC0402FR-0733RL/YAGEO; Part Reference: R190; CLASS: DISCRETE; FPLIST: RC0402_25,RC0402_HD,RC0402_CC; CAD_APPROVED: Yes; MFG_PN01: RK73B1ETTP472J; MFG_NAME01: KOA SPEER; Tolerance: 5%; AGILE_PN: 470-75626; ROHS: Yes; TOL: 5%; HEIGHT: 0.41mm; PCB Footprint: R0402
R178 = RES_Dup2: AC0402FR-074K7L/YAGEO; Part Reference: R191; CLASS: DISCRETE; TOL: 5%; AGILE_PN: 470-75626; MFG_NAME01: KOA SPEER; MFG_PN01: RK73B1ETTP472J; CAD_APPROVED: Yes; FPLIST: RC0402_25,RC0402_HD,RC0402_CC; HEIGHT: 0.41mm; Tolerance: 5%; ROHS: Yes; PCB Footprint: R0402
R179 = RES_Dup2: AC0402FR-074K7L/YAGEO; Part Reference: R192; CLASS: DISCRETE; FPLIST: RC0402_25,RC0402_HD,RC0402_CC; CAD_APPROVED: Yes; MFG_PN01: RK73B1ETTP472J; MFG_NAME01: KOA SPEER; Tolerance: 5%; AGILE_PN: 470-75626; ROHS: Yes; TOL: 5%; HEIGHT: 0.41mm; PCB Footprint: R0402
R180 = RES_Dup2: AC0402FR-074K7L/YAGEO; Part Reference: R193; CLASS: DISCRETE; TOL: 5%; AGILE_PN: 470-75626; MFG_NAME01: KOA SPEER; MFG_PN01: RK73B1ETTP472J; CAD_APPROVED: Yes; FPLIST: RC0402_25,RC0402_HD,RC0402_CC; HEIGHT: 0.41mm; Tolerance: 5%; ROHS: Yes; PCB Footprint: R0402
R181 = RES_Dup2: AC0402FR-074K7L/YAGEO; Part Reference: R194; CLASS: DISCRETE; FPLIST: RC0402_25,RC0402_HD,RC0402_CC; CAD_APPROVED: Yes; MFG_PN01: RK73B1ETTP472J; MFG_NAME01: KOA SPEER; Tolerance: 5%; AGILE_PN: 470-75626; ROHS: Yes; TOL: 5%; HEIGHT: 0.41mm; PCB Footprint: R0402
R182 = RES_Dup2: AC0402FR-071KL/YAGEO; Part Reference: R195; CLASS: DISCRETE; TOL: 5%; AGILE_PN: 470-75555; MFG_NAME01: VISHAY INTERTECHNOLOGY; MFG_PN01: CRCW04021K00JNED; CAD_APPROVED: Yes; FPLIST: RC0402_25,RC0402_HD,RC0402_CC; 物料封装: R0402; HEIGHT: 0.41mm; Tolerance: 5%; ROHS: Yes; PCB Footprint: R0402
R184 = RES_Dup2: AC0402FR-074K7L/YAGEO; Part Reference: R197; CLASS: DISCRETE; TOL: 5%; AGILE_PN: 470-75626; MFG_NAME01: KOA SPEER; MFG_PN01: RK73B1ETTP472J; CAD_APPROVED: Yes; FPLIST: RC0402_25,RC0402_HD,RC0402_CC; HEIGHT: 0.41mm; Tolerance: 5%; ROHS: Yes; PCB Footprint: R0402
R186 = RES_Dup2: AC0402FR-074K7L/YAGEO; Part Reference: R199; CLASS: DISCRETE; FPLIST: RC0402_25,RC0402_HD,RC0402_CC; CAD_APPROVED: Yes; MFG_PN01: RK73B1ETTP472J; MFG_NAME01: KOA SPEER; Tolerance: 5%; AGILE_PN: 470-75626; ROHS: Yes; TOL: 5%; HEIGHT: 0.41mm; PCB Footprint: R0402
R187 = RES_Dup2: AC0402FR-071KL/YAGEO; Part Reference: R200; CLASS: DISCRETE; TOL: 5%; AGILE_PN: 470-75555; MFG_NAME01: VISHAY INTERTECHNOLOGY; MFG_PN01: CRCW04021K00JNED; CAD_APPROVED: Yes; FPLIST: RC0402_25,RC0402_HD,RC0402_CC; 物料封装: R0402; HEIGHT: 0.41mm; Tolerance: 5%; ROHS: Yes; PCB Footprint: R0402
R188 = RES_Dup2: AC0402FR-0733RL/YAGEO; Part Reference: R201; CLASS: DISCRETE; TOL: 5%; AGILE_PN: 470-75626; MFG_NAME01: KOA SPEER; MFG_PN01: RK73B1ETTP472J; CAD_APPROVED: Yes; FPLIST: RC0402_25,RC0402_HD,RC0402_CC; HEIGHT: 0.41mm; Tolerance: 5%; ROHS: Yes; PCB Footprint: R0402
R190 = RES_Dup2: AC0402FR-074K7L/YAGEO; Part Reference: R203; CLASS: DISCRETE; TOL: 5%; AGILE_PN: 470-75626; MFG_NAME01: KOA SPEER; MFG_PN01: RK73B1ETTP472J; CAD_APPROVED: Yes; FPLIST: RC0402_25,RC0402_HD,RC0402_CC; HEIGHT: 0.41mm; Tolerance: 5%; ROHS: Yes; PCB Footprint: R0402
R191 = RES_Dup2: AC0402FR-074K7L/YAGEO; Part Reference: R204; CLASS: DISCRETE; FPLIST: RC0402_25,RC0402_HD,RC0402_CC; CAD_APPROVED: Yes; MFG_PN01: RK73B1ETTP472J; MFG_NAME01: KOA SPEER; Tolerance: 5%; AGILE_PN: 470-75626; ROHS: Yes; TOL: 5%; HEIGHT: 0.41mm; PCB Footprint: R0402
R192 = RES_Dup2: AC0402FR-0733RL/YAGEO; Part Reference: R205; CLASS: DISCRETE; TOL: 5%; AGILE_PN: 470-75626; MFG_NAME01: KOA SPEER; MFG_PN01: RK73B1ETTP472J; CAD_APPROVED: Yes; FPLIST: RC0402_25,RC0402_HD,RC0402_CC; HEIGHT: 0.41mm; Tolerance: 5%; ROHS: Yes; PCB Footprint: R0402
R193 = RES_Dup2: AC0402FR-074K7L/YAGEO; Part Reference: R206; CLASS: DISCRETE; TOL: 5%; AGILE_PN: 470-75626; MFG_NAME01: KOA SPEER; MFG_PN01: RK73B1ETTP472J; CAD_APPROVED: Yes; FPLIST: RC0402_25,RC0402_HD,RC0402_CC; HEIGHT: 0.41mm; Tolerance: 5%; ROHS: Yes; PCB Footprint: R0402
R194 = RES_Dup2: AC0402FR-0749R9L/YAGEO; Part Reference: R207; CLASS: DISCRETE; FPLIST: RC0402_25,RC0402_HD,RC0402_CC; CAD_APPROVED: Yes; MFG_PN01: RK73B1ETTP472J; MFG_NAME01: KOA SPEER; Tolerance: 5%; AGILE_PN: 470-75626; ROHS: Yes; TOL: 5%; HEIGHT: 0.41mm; PCB Footprint: R0402
R195 = RES_Dup2: AC0402FR-0749R9L/YAGEO; Part Reference: R209; CLASS: DISCRETE; TOL: 5%; AGILE_PN: 470-75626; MFG_NAME01: KOA SPEER; MFG_PN01: RK73B1ETTP472J; CAD_APPROVED: Yes; FPLIST: RC0402_25,RC0402_HD,RC0402_CC; HEIGHT: 0.41mm; Tolerance: 5%; ROHS: Yes; PCB Footprint: R0402
U1 = SiT9365AI-4B2-33E156.25MHZ: SiT9365AI-4B2-33E156.25MHZ/SITIME; Part Reference: U1; PCB Footprint: X6-3225m-SIT9365AI-4B2-33E156_25MHZ; Value: SX3DF156.250B20F30DNN